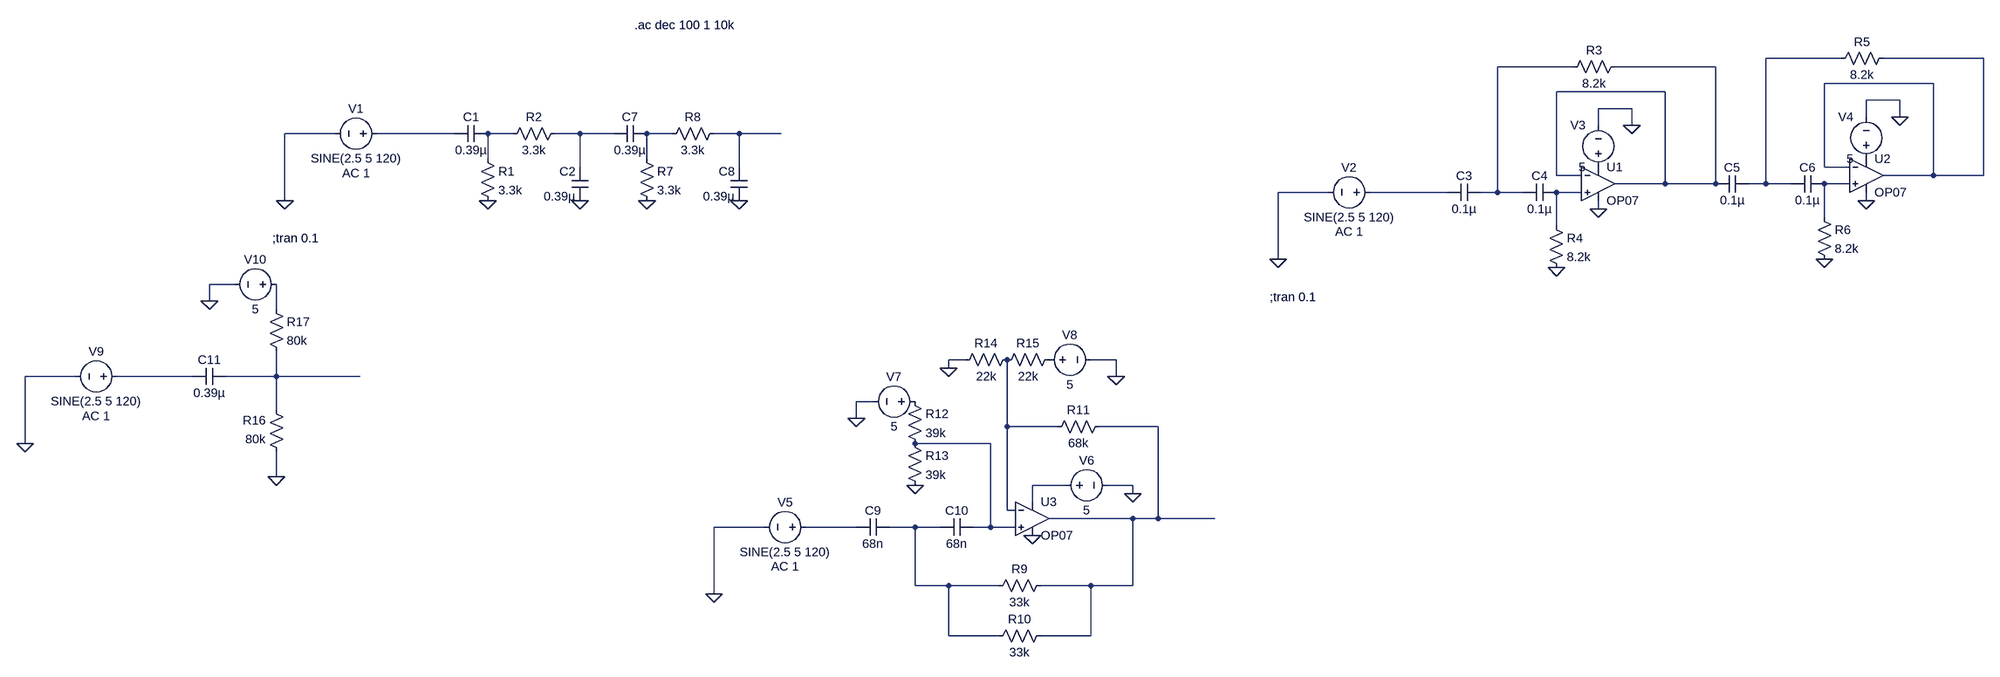
[diagram p0: schematic SignalConditioningPrototypes.asc]
SignalConditioningPrototypes.asc, the LTspice schematic file:
Version 4
SHEET 1 2724 1056
WIRE 2448 -208 2304 -208
WIRE 2720 -208 2528 -208
WIRE 1936 -192 1792 -192
WIRE 2208 -192 2016 -192
WIRE 2624 -160 2416 -160
WIRE 2112 -144 1904 -144
WIRE 2560 -128 2496 -128
WIRE 2048 -112 1984 -112
WIRE 2496 -96 2496 -128
WIRE 2560 -96 2560 -128
WIRE 1984 -80 1984 -112
WIRE 2048 -80 2048 -112
WIRE -912 -64 -1008 -64
WIRE -576 -64 -832 -64
WIRE -464 -64 -512 -64
WIRE -336 -64 -384 -64
WIRE -272 -64 -336 -64
WIRE -160 -64 -208 -64
WIRE -32 -64 -80 -64
WIRE 48 -64 -32 -64
WIRE -512 -16 -512 -64
WIRE -208 -16 -208 -64
WIRE -336 0 -336 -64
WIRE -32 0 -32 -64
WIRE 2416 0 2416 -160
WIRE 2464 0 2416 0
WIRE 1904 16 1904 -144
WIRE 1952 16 1904 16
WIRE 2624 16 2624 -160
WIRE 2624 16 2528 16
WIRE 2720 16 2720 -208
WIRE 2720 16 2624 16
WIRE 2112 32 2112 -144
WIRE 2112 32 2016 32
WIRE 2208 32 2208 -192
WIRE 2208 32 2112 32
WIRE 2304 32 2304 -208
WIRE 2304 32 2272 32
WIRE 2352 32 2304 32
WIRE 2464 32 2416 32
WIRE 1360 48 1264 48
WIRE 1696 48 1440 48
WIRE 1792 48 1792 -192
WIRE 1792 48 1760 48
WIRE 1840 48 1792 48
WIRE 1952 48 1904 48
WIRE -1008 64 -1008 -64
WIRE 2496 64 2496 48
WIRE 1984 80 1984 64
WIRE 2416 96 2416 32
WIRE 1904 112 1904 48
WIRE 1264 176 1264 48
WIRE -1104 224 -1152 224
WIRE -1152 256 -1152 224
WIRE -1024 272 -1024 224
WIRE 400 368 368 368
WIRE 688 368 640 368
WIRE 368 384 368 368
WIRE -1408 400 -1504 400
WIRE -1184 400 -1328 400
WIRE -1024 400 -1024 352
WIRE -1024 400 -1120 400
WIRE -864 400 -1024 400
WIRE 688 400 688 368
WIRE 224 448 192 448
WIRE -1024 464 -1024 400
WIRE 192 480 192 448
WIRE 480 496 480 368
WIRE 576 496 480 496
WIRE 768 496 656 496
WIRE -1504 528 -1504 400
WIRE 448 528 304 528
WIRE -1024 592 -1024 544
WIRE 592 608 528 608
WIRE 720 608 672 608
WIRE 720 624 720 608
WIRE 528 640 528 608
WIRE 480 656 480 496
WIRE 496 656 480 656
WIRE 720 672 560 672
WIRE 768 672 768 496
WIRE 768 672 720 672
WIRE 928 672 768 672
WIRE 16 688 -80 688
WIRE 192 688 96 688
WIRE 304 688 256 688
WIRE 352 688 304 688
WIRE 448 688 448 528
WIRE 448 688 416 688
WIRE 496 688 448 688
WIRE 304 800 304 688
WIRE 368 800 304 800
WIRE 464 800 368 800
WIRE 640 800 544 800
WIRE 720 800 720 672
WIRE 720 800 640 800
WIRE -80 816 -80 688
WIRE 368 896 368 800
WIRE 464 896 368 896
WIRE 640 896 640 800
WIRE 640 896 544 896
FLAG -1008 64 0
FLAG -512 64 0
FLAG -336 64 0
FLAG 1264 176 0
FLAG 2048 -80 0
FLAG 1984 80 0
FLAG 1904 192 0
FLAG 2560 -96 0
FLAG 2496 64 0
FLAG 2416 176 0
FLAG -208 64 0
FLAG -32 64 0
FLAG -80 816 0
FLAG 720 624 0
FLAG 304 608 0
FLAG 192 480 0
FLAG 528 704 0
FLAG 368 384 0
FLAG 688 400 0
FLAG -1024 592 0
FLAG -1504 528 0
FLAG -1152 256 0
SYMBOL voltage -816 -64 R90
WINDOW 0 -32 56 VBottom 2
WINDOW 3 32 56 VTop 2
WINDOW 123 60 56 VTop 2
WINDOW 39 0 0 Left 0
SYMATTR InstName V1
SYMATTR Value SINE(2.5 5 120)
SYMATTR Value2 AC 1
SYMBOL cap -512 -80 R90
WINDOW 0 0 32 VBottom 2
WINDOW 3 32 32 VTop 2
SYMATTR InstName C1
SYMATTR Value 0.39µ
SYMBOL cap -320 64 R180
WINDOW 0 24 56 Left 2
WINDOW 3 24 8 Left 2
SYMATTR InstName C2
SYMATTR Value 0.39µ
SYMBOL res -528 -32 R0
SYMATTR InstName R1
SYMATTR Value 3.3k
SYMBOL res -368 -80 R90
WINDOW 0 0 56 VBottom 2
WINDOW 3 32 56 VTop 2
SYMATTR InstName R2
SYMATTR Value 3.3k
SYMBOL voltage 1456 48 R90
WINDOW 0 -32 56 VBottom 2
WINDOW 3 32 56 VTop 2
WINDOW 123 60 56 VTop 2
WINDOW 39 0 0 Left 0
SYMATTR InstName V2
SYMATTR Value SINE(2.5 5 120)
SYMATTR Value2 AC 1
SYMBOL cap 1760 32 R90
WINDOW 0 0 32 VBottom 2
WINDOW 3 32 32 VTop 2
SYMATTR InstName C3
SYMATTR Value 0.1µ
SYMBOL cap 1904 32 R90
WINDOW 0 0 32 VBottom 2
WINDOW 3 32 32 VTop 2
SYMATTR InstName C4
SYMATTR Value 0.1µ
SYMBOL OpAmps\\OP07 1984 -32 R0
SYMATTR InstName U1
SYMBOL res 2032 -208 R90
WINDOW 0 0 56 VBottom 2
WINDOW 3 32 56 VTop 2
SYMATTR InstName R3
SYMATTR Value 8.2k
SYMBOL voltage 1984 16 R180
WINDOW 0 24 96 Left 2
WINDOW 3 24 16 Left 2
WINDOW 123 0 0 Left 0
WINDOW 39 0 0 Left 0
SYMATTR InstName V3
SYMATTR Value 5
SYMBOL res 1888 96 R0
SYMATTR InstName R4
SYMATTR Value 8.2k
SYMBOL cap 2272 16 R90
WINDOW 0 0 32 VBottom 2
WINDOW 3 32 32 VTop 2
SYMATTR InstName C5
SYMATTR Value 0.1µ
SYMBOL cap 2416 16 R90
WINDOW 0 0 32 VBottom 2
WINDOW 3 32 32 VTop 2
SYMATTR InstName C6
SYMATTR Value 0.1µ
SYMBOL OpAmps\\OP07 2496 -48 R0
SYMATTR InstName U2
SYMBOL res 2544 -224 R90
WINDOW 0 0 56 VBottom 2
WINDOW 3 32 56 VTop 2
SYMATTR InstName R5
SYMATTR Value 8.2k
SYMBOL voltage 2496 0 R180
WINDOW 0 24 96 Left 2
WINDOW 3 24 16 Left 2
WINDOW 123 0 0 Left 0
WINDOW 39 0 0 Left 0
SYMATTR InstName V4
SYMATTR Value 5
SYMBOL res 2400 80 R0
SYMATTR InstName R6
SYMATTR Value 8.2k
SYMBOL cap -208 -80 R90
WINDOW 0 0 32 VBottom 2
WINDOW 3 32 32 VTop 2
SYMATTR InstName C7
SYMATTR Value 0.39µ
SYMBOL cap -16 64 R180
WINDOW 0 24 56 Left 2
WINDOW 3 24 8 Left 2
SYMATTR InstName C8
SYMATTR Value 0.39µ
SYMBOL res -224 -32 R0
SYMATTR InstName R7
SYMATTR Value 3.3k
SYMBOL res -64 -80 R90
WINDOW 0 0 56 VBottom 2
WINDOW 3 32 56 VTop 2
SYMATTR InstName R8
SYMATTR Value 3.3k
SYMBOL voltage 112 688 R90
WINDOW 0 -32 56 VBottom 2
WINDOW 3 32 56 VTop 2
WINDOW 123 60 56 VTop 2
WINDOW 39 0 0 Left 0
SYMATTR InstName V5
SYMATTR Value SINE(2.5 5 120)
SYMATTR Value2 AC 1
SYMBOL cap 256 672 R90
WINDOW 0 0 32 VBottom 2
WINDOW 3 32 32 VTop 2
SYMATTR InstName C9
SYMATTR Value 68n
SYMBOL cap 416 672 R90
WINDOW 0 0 32 VBottom 2
WINDOW 3 32 32 VTop 2
SYMATTR InstName C10
SYMATTR Value 68n
SYMBOL res 560 784 R90
WINDOW 0 0 56 VBottom 2
WINDOW 3 32 56 VTop 2
SYMATTR InstName R9
SYMATTR Value 33k
SYMBOL res 560 880 R90
WINDOW 0 0 56 VBottom 2
WINDOW 3 32 56 VTop 2
SYMATTR InstName R10
SYMATTR Value 33k
SYMBOL res 672 480 R90
WINDOW 0 0 56 VBottom 2
WINDOW 3 32 56 VTop 2
SYMATTR InstName R11
SYMATTR Value 68k
SYMBOL voltage 576 608 R270
WINDOW 0 32 56 VTop 2
WINDOW 3 -32 56 VBottom 2
WINDOW 123 0 0 Left 0
WINDOW 39 0 0 Left 0
SYMATTR InstName V6
SYMATTR Value 5
SYMBOL res 288 432 R0
SYMATTR InstName R12
SYMATTR Value 39k
SYMBOL res 288 512 R0
SYMATTR InstName R13
SYMATTR Value 39k
SYMBOL voltage 320 448 R90
WINDOW 0 -32 56 VBottom 2
WINDOW 3 32 56 VTop 2
WINDOW 123 0 0 Left 0
WINDOW 39 0 0 Left 0
SYMATTR InstName V7
SYMATTR Value 5
SYMBOL res 496 352 R90
WINDOW 0 0 56 VBottom 2
WINDOW 3 32 56 VTop 2
SYMATTR InstName R14
SYMATTR Value 22k
SYMBOL res 576 352 R90
WINDOW 0 0 56 VBottom 2
WINDOW 3 32 56 VTop 2
SYMATTR InstName R15
SYMATTR Value 22k
SYMBOL voltage 544 368 R270
WINDOW 0 32 56 VTop 2
WINDOW 3 -32 56 VBottom 2
WINDOW 123 0 0 Left 0
WINDOW 39 0 0 Left 0
SYMATTR InstName V8
SYMATTR Value 5
SYMBOL OpAmps\\OP07 528 608 R0
SYMATTR InstName U3
SYMBOL res -1008 560 R180
WINDOW 0 36 76 Left 2
WINDOW 3 36 40 Left 2
SYMATTR InstName R16
SYMATTR Value 80k
SYMBOL cap -1120 384 R90
WINDOW 0 0 32 VBottom 2
WINDOW 3 32 32 VTop 2
SYMATTR InstName C11
SYMATTR Value 0.39µ
SYMBOL voltage -1312 400 R90
WINDOW 0 -32 56 VBottom 2
WINDOW 3 32 56 VTop 2
WINDOW 123 60 56 VTop 2
WINDOW 39 0 0 Left 0
SYMATTR InstName V9
SYMATTR Value SINE(2.5 5 120)
SYMATTR Value2 AC 1
SYMBOL res -1040 256 R0
SYMATTR InstName R17
SYMATTR Value 80k
SYMBOL voltage -1008 224 R90
WINDOW 0 -32 56 VBottom 2
WINDOW 3 32 56 VTop 2
WINDOW 123 0 0 Left 0
WINDOW 39 0 0 Left 0
SYMATTR InstName V10
SYMATTR Value 5
TEXT -1032 136 Left 2 !;tran 0.1
TEXT -232 -272 Left 2 !.ac dec 100 1 10k
TEXT 1248 248 Left 2 !;tran 0.1

The netlist it stands for:
* SignalConditioningPrototypes.asc
V1 N005 0 SINE(2.5 5 120) AC 1
C1 N006 N005 0.39µ
C2 0 N007 0.39µ
R1 N006 0 3.3k
R2 N007 N006 3.3k
V2 N011 0 SINE(2.5 5 120) AC 1
C3 N003 N011 0.1µ
C4 N012 N003 0.1µ
XU1 N012 N004 P001 0 N004 LT1001  ; OP07, pins In+ In- V+ V- OUT
R3 N004 N003 8.2k
V3 P001 0 5
R4 N012 0 8.2k
C5 N001 N004 0.1µ
C6 N010 N001 0.1µ
XU2 N010 N002 P002 0 N002 LT1001  ; OP07, pins In+ In- V+ V- OUT
R5 N002 N001 8.2k
V4 P002 0 5
R6 N010 0 8.2k
C7 N008 N007 0.39µ
C8 0 N009 0.39µ
R7 N008 0 3.3k
R8 N009 N008 3.3k
V5 N020 0 SINE(2.5 5 120) AC 1
C9 N021 N020 68n
C10 N018 N021 68n
R9 N017 N021 33k
R10 N017 N021 33k
R11 N017 N016 68k
V6 N019 0 5
R12 P003 N018 39k
R13 N018 0 39k
V7 P003 0 5
R14 N016 0 22k
R15 P004 N016 22k
V8 P004 0 5
XU3 N018 N016 N019 0 N017 LT1001  ; OP07, pins In+ In- V+ V- OUT
R16 0 N015 80k
C11 N015 N014 0.39µ
V9 N014 0 SINE(2.5 5 120) AC 1
R17 N013 N015 80k
V10 N013 0 5
;tran 0.1
.ac dec 100 1 10k
;tran 0.1
.lib LTC.lib
.backanno
.end